# EasyEDA Pro project USB_C_BREADBOARD_PD.eprj, schematic Schematic3
Board Name: SMART_V; Create Date: 2025-01-21; Page Name: P1; Project Name: USB_C_BREADBOARD_PD; Schematic Name: Schematic3; Update Date: 2025-01-20; Company: EasyEDA.com; Page Size: A4; Version: V1.0
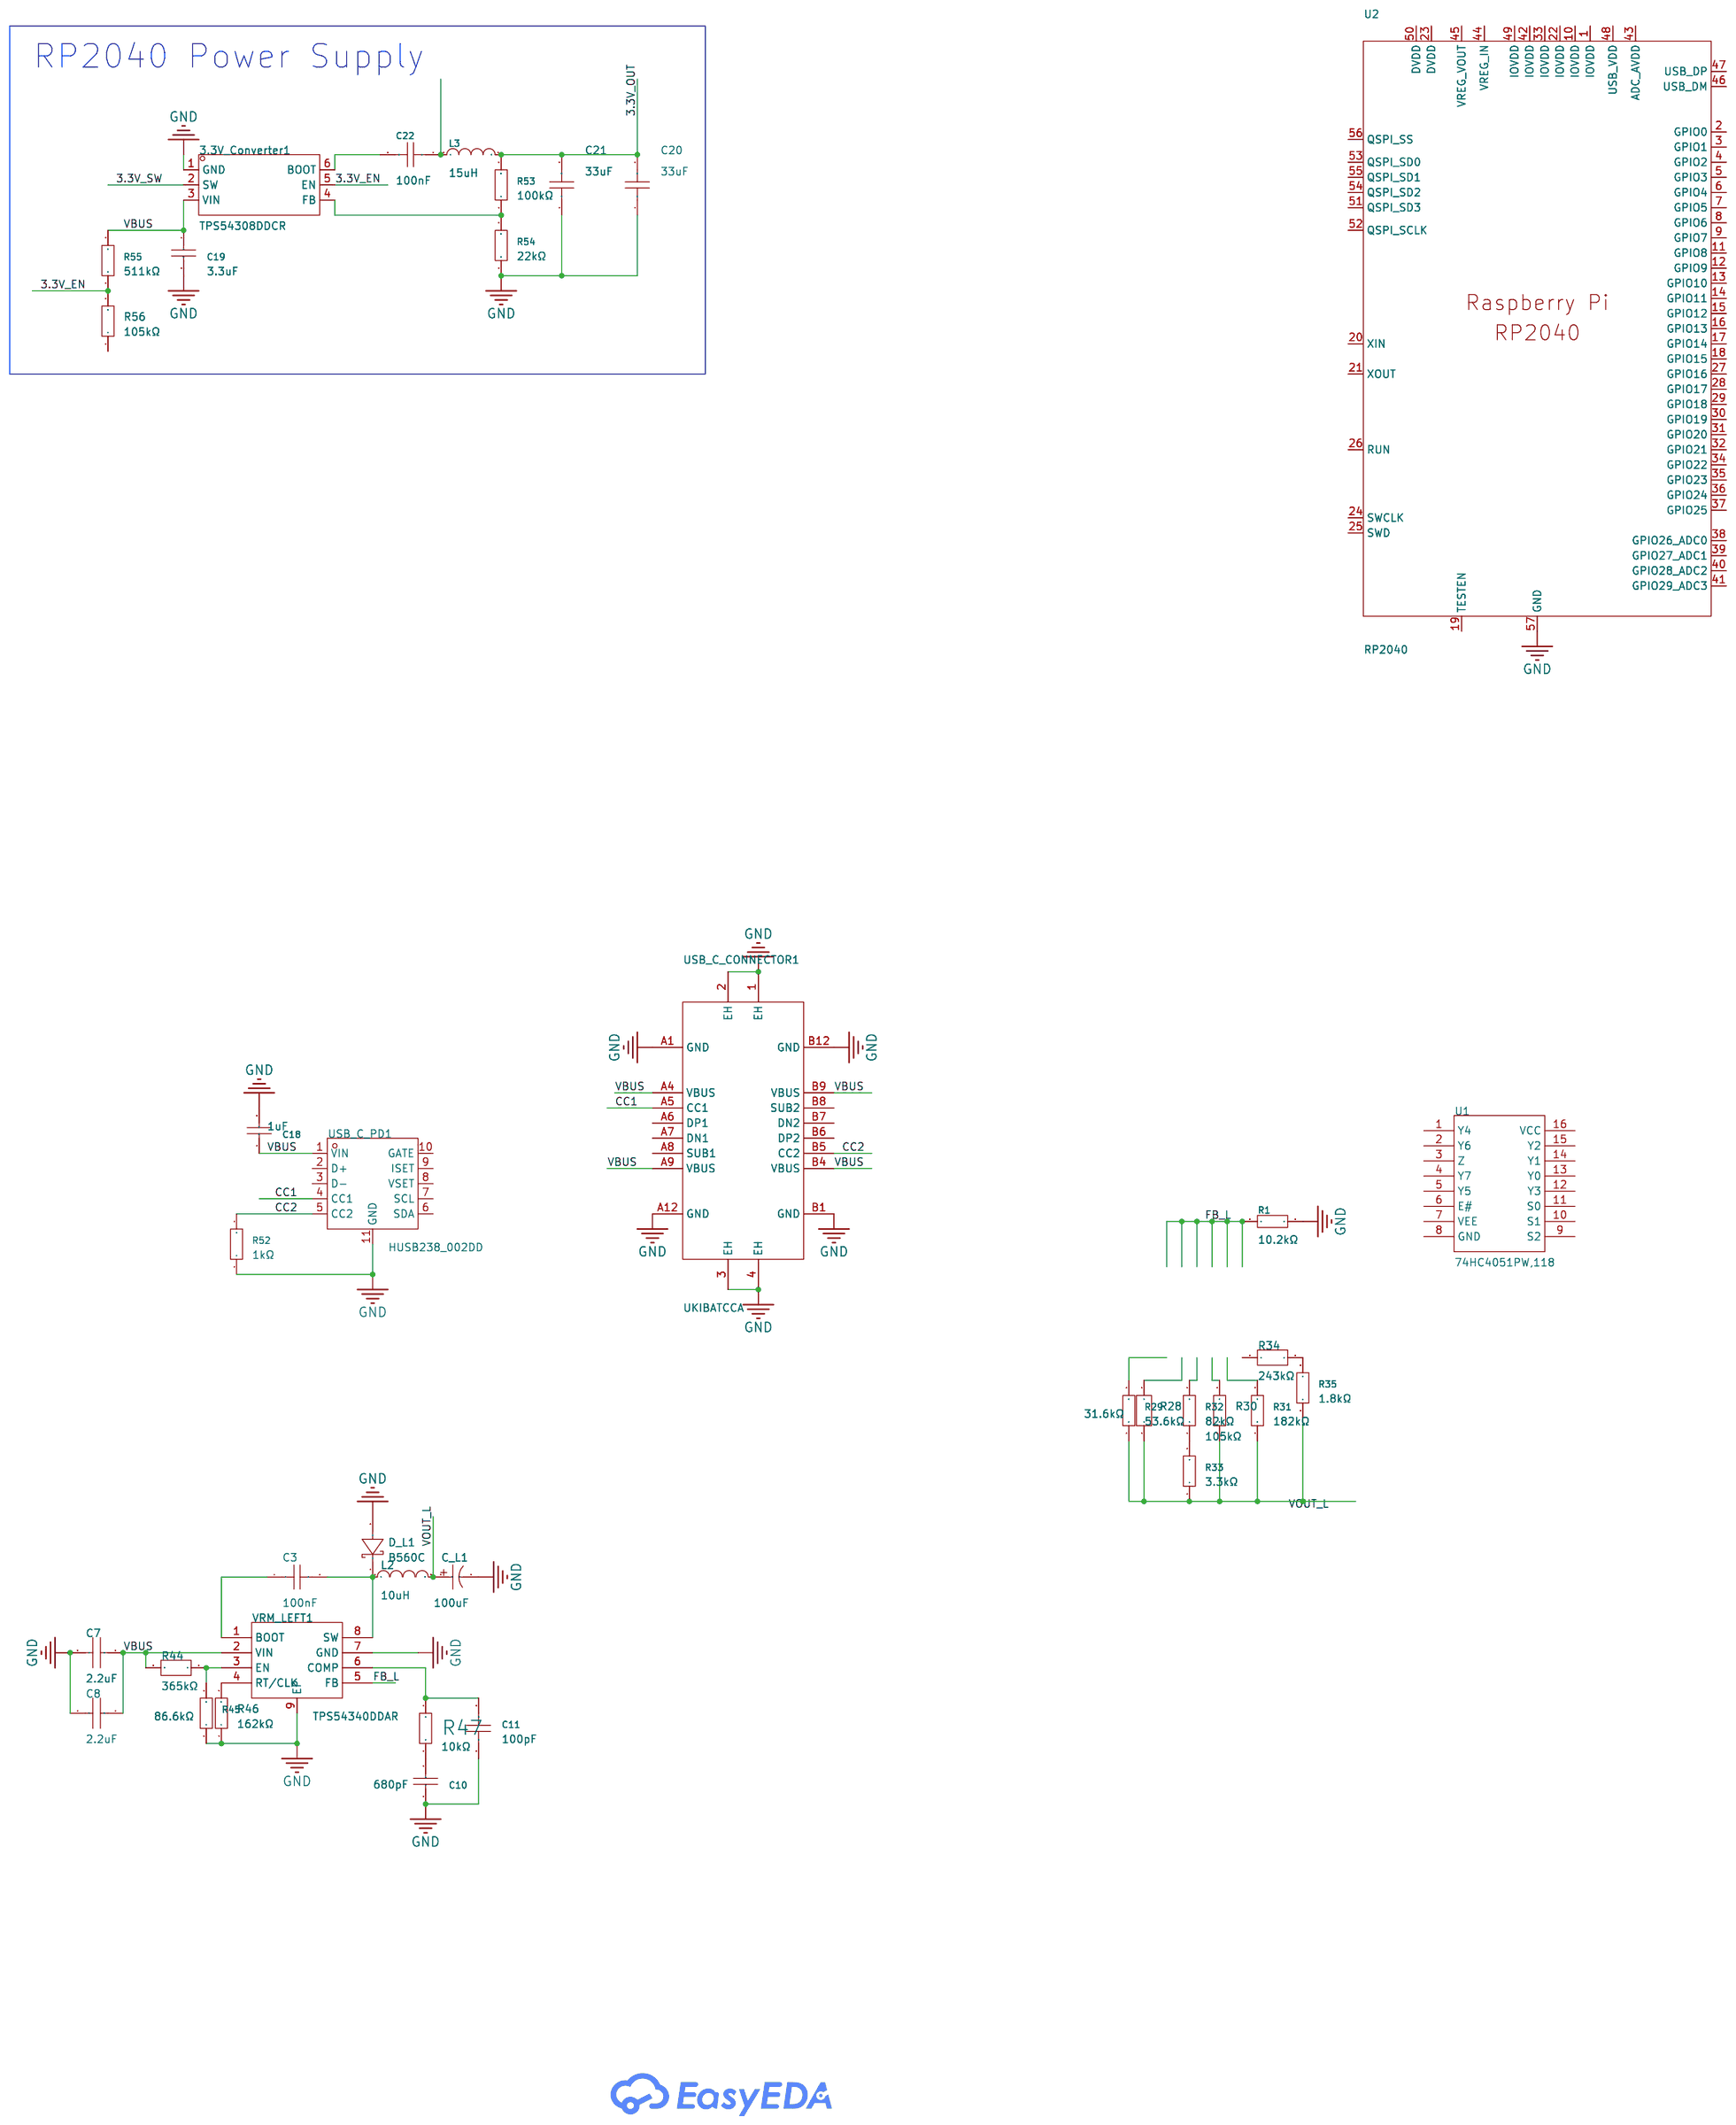
[diagram p2: schematic sheet]

## Parts
3.3V_Converter1  TPS54308DDCR  [SOT-23-6_L2.9-W1.6-P0.95-LS2.8-BR]
C3  100nF  [C0603]
C7  2.2uF  [C0402]
C8  2.2uF  [C0402]
C10  680pF  [C0603]
C11  100pF  [C0603]
C18  1uF  [C0402]
C19  3.3uF  [C1206]
C20  33uF  [C0805]
C21  33uF  [C0805]
C22  100nF  [C0603]
C_L1  100uF  [CAP-SMD_BD6.3-L6.6-W6.6-LS7.6-FD]
D_L1  B560C  [SMC_L6.9-W5.9-LS7.9-RD]
L2  10uH  [IND-SMD_L7.3-W6.8]
L3  15uH  [IND-SMD_L3.0-W3.0_LQH3NPN]
R1  10.2kΩ  [R0402]
R28  53.6kΩ  [R0603]
R29  31.6kΩ  [R0603]
R30  105kΩ  [R0603]
R31  182kΩ  [R0603]
R32  82kΩ  [R0603]
R33  3.3kΩ  [R0603]
R34  243kΩ  [R0603]
R35  1.8kΩ  [R0603]
R44  365kΩ  [R0603]
R45  86.6kΩ  [R0603]
R46  162kΩ  [R0603]
R47  10kΩ  [R0603]
R52  1kΩ  [R0402]
R53  100kΩ  [R0402]
R54  22kΩ  [R0603]
R55  511kΩ  [R0402]
R56  105kΩ  [R0603]
U1  74HC4051PW,118  [TSSOP-16_L5.0-W4.4-P0.65-LS6.4-BL]
U2  RP2040  [LQFN-56_L7.0-W7.0-P0.4-EP]
USB_C_CONNECTOR1  UKIBATCCA  [USB-C-SMD_UKIBATCCA]
USB_C_PD1  HUSB238_002DD  [DFN-10_L3.0-W3.0-P0.50-BL-EP2.5]
VRM_LEFT1  TPS54340DDAR  [SOIC-8_L4.9-W3.9-P1.27-LS6.0-BL-EP3.3]

## Library data of the parts
3.3V_Converter1 = TPS54308DDCR: LCSC Part Name: 4.5V至28V输入,3A输出同步降压转换器; Supplier Part: C168839; Manufacturer: TI(德州仪器); Supplier Footprint: SOT-23-6; JLCPCB Part Class: Extended Part; Datasheet: https://www.ti.com/cn/lit/gpn/tps54308; Supplier: LCSC; Function: Step-down type; Output Type: Fixed; Input Voltage: 4.5V~28V; Output Voltage: 3.3V; Output Current: 3A; Switching Frequency: 350kHz; Operating Temperature: -40℃~+125℃; Synchronous Rectification: Yes; Number of Outputs: 1; Topology: Step-down; Quiescent Current (Iq): 300uA; Switch tube (built-in/external): Built-in
C3 = CGA0603X7R104K500JT: LCSC Part Name: 100nF ±10% 50V; Supplier Part: C6119867; Manufacturer: HRE(芯声); Supplier Footprint: 0603; JLCPCB Part Class: Extended Part; Supplier: LCSC; Tolerance: ±10%; Voltage Rated: 50V
C7 C8 = CL05A225MQ5NSNC: LCSC Part Name: 2.2uF ±20% 6.3V; Supplier Part: C12530; Manufacturer: SAMSUNG(三星); Supplier Footprint: 0402; JLCPCB Part Class: Basic Part; Datasheet: https://atta.szlcsc.com/upload/public/pdf/source/20160218/1457707763339.pdf; Supplier: LCSC; Tolerance: ±20%
C10 = CC0603JRNPO9BN681: LCSC Part Name: 680pF ±5% 50V; Supplier Part: C107055; Manufacturer: YAGEO(国巨); Supplier Footprint: 0603; JLCPCB Part Class: Extended Part; Datasheet: https://atta.szlcsc.com/upload/public/pdf/source/20170914/C128857_1505359892143968080.pdf; Supplier: LCSC; Tolerance: ±5%
C11 = CC0603JRNPO9BN101: LCSC Part Name: 100pF ±5% 50V; Supplier Part: C14665; Manufacturer: YAGEO(国巨); Supplier Footprint: 0603; JLCPCB Part Class: Extended Part; Datasheet: https://atta.szlcsc.com/upload/public/pdf/source/20181008/C309499_21CC21451B82C39E3D92150FD6B30293.pdf; Supplier: LCSC; Tolerance: ±5%
C18 = CL05A105KO5NNNC: LCSC Part Name: 1uF ±10% 16V; Supplier Part: C29266; Manufacturer: SAMSUNG(三星); Supplier Footprint: 0402; JLCPCB Part Class: Extended Part; Datasheet: https://atta.szlcsc.com/upload/public/pdf/source/20160218/1457707763339.pdf; Supplier: LCSC; Tolerance: ±10%
C19 = C3216X7R1E335KT000N: LCSC Part Name: 3.3uF ±10% 25V; Supplier Part: C76663; Manufacturer: TDK; Supplier Footprint: 1206; JLCPCB Part Class: Extended Part; Datasheet: https://atta.szlcsc.com/upload/public/pdf/source/20191009/C435256_A698304126E0DD2EAD15F9D05758F127.pdf; Supplier: LCSC; Tolerance: ±10%
C20 C21 = C2012X5R1A336MTJ00E: LCSC Part Name: 33uF ±20% 10V; Supplier Part: C342635; Manufacturer: TDK; Supplier Footprint: 0805; JLCPCB Part Class: Extended Part; Datasheet: https://atta.szlcsc.com/upload/public/pdf/source/20190612/C361180_85CC9FB0751BEA97238DE56AB4AF0B1F.pdf; Supplier: LCSC; Tolerance: ±20%
C22 = CC0603KRX7R9BB104: LCSC Part Name: 100nF ±10% 50V; Supplier Part: C14663; Manufacturer: YAGEO(国巨); Supplier Footprint: 0603; JLCPCB Part Class: Basic Part; Datasheet: https://atta.szlcsc.com/upload/public/pdf/source/20180910/C282072_33301C7F631E79921B82A8DAC6BCC5B3.pdf; Supplier: LCSC; Tolerance: ±10%
C_L1 = RVT1V101M0607_C72478: LCSC Part Name: 100uF ±20% 35V; Supplier Part: C72478; Manufacturer: ROQANG(容强); Manufacturer Part: RVT1V101M0607; Supplier Footprint: SMD,D6.3xL7.7mm; JLCPCB Part Class: Extended Part; Datasheet: https://atta.szlcsc.com/upload/public/pdf/source/20170325/1490427950282.pdf; Supplier: LCSC; Tolerance: ±20%; Ripple Current: 69mA@120Hz; Lifetime @ Temp: 2000hrs@105℃; Operating Temperature: -40℃~+105℃
D_L1 = B560C_C6807784: LCSC Part Name: 电压:60V 电流:5A; Supplier Part: C6807784; Manufacturer: FUXINSEMI(富芯森美); Supplier Footprint: SMC(DO-214AB); JLCPCB Part Class: Extended Part; Datasheet: https://atta.szlcsc.com/upload/public/pdf/source/20230727/BBD047E09E3983A1DBEAE079A1E2DA84.pdf; Supplier: LCSC; Diode Configuration: Independent Type; Forward Voltage (Vf@If): 700mV@5A; Reverse Voltage (Vr): 60V; Rectified Current: 5A; Reverse Leakage Current (Ir): 100uA@60V
L2 = FXL0630-100-M: LCSC Part Name: 10uH ±20% 5.5A; Supplier Part: C167223; Manufacturer: cjiang(长江微电); Supplier Footprint: SMD,6.6x7mm; JLCPCB Part Class: Extended Part; Datasheet: https://atta.szlcsc.com/upload/public/pdf/source/20240426/3189EA8206330E2108542F9E34E540E7.pdf; Supplier: LCSC; Tolerance: ±20%; Saturation Current (Isat): 5.5A; Type: Integrated molded inductor
L3 = LQH3NPN150MMEL: LCSC Part Name: 15uH ±20% 660mA; Supplier Part: C668450; Manufacturer: muRata(村田); Supplier Footprint: SMD,3x3mm; JLCPCB Part Class: Extended Part; Datasheet: https://atta.szlcsc.com/upload/public/pdf/source/20191022/C440248_094C93E028FCF0FA66FA57BC1ADCD3EF.pdf; Supplier: LCSC; Tolerance: ±20%; Saturation Current (Isat): 660mA
R1 = 0402WGF1022TCE: LCSC Part Name: 10.2kΩ ±1% 62.5mW 厚膜电阻; Supplier Part: C11660; Manufacturer: UNI-ROYAL(厚声); Supplier Footprint: 0402; JLCPCB Part Class: Extended Part; Datasheet: https://atta.szlcsc.com/upload/public/pdf/source/20200306/C422600_1E6D84923E4A46A82E41ADD87F860B5C.pdf; Supplier: LCSC; Type: Thick Film Resistors; Tolerance: ±1%; Temperature Coefficient: ±100ppm/℃; Operating Temperature Range: -55℃~+155℃
R28 = FRC0603F5362TS: LCSC Part Name: 53.6kΩ ±1% 100mW 厚膜电阻; Supplier Part: C2930115; Manufacturer: FOJAN(富捷); Supplier Footprint: 0603; JLCPCB Part Class: Extended Part; Datasheet: https://atta.szlcsc.com/upload/public/pdf/source/20211221/925EC7D7225764EE0046F22065062C87.pdf; Supplier: LCSC; Type: Thick Film Resistors; Tolerance: ±1%; Temperature Coefficient: ±100ppm/℃; Operating Temperature Range: -55℃~+155℃
R29 = 0603WAF3162T5E: LCSC Part Name: 31.6kΩ ±1% 100mW 厚膜电阻; Supplier Part: C25967; Manufacturer: UNI-ROYAL(厚声); Supplier Footprint: 0603; JLCPCB Part Class: Extended Part; Datasheet: https://atta.szlcsc.com/upload/public/pdf/source/20200306/C422600_1E6D84923E4A46A82E41ADD87F860B5C.pdf; Supplier: LCSC; Type: Thick Film Resistors; Tolerance: ±1%; Temperature Coefficient: ±100ppm/℃; Operating Temperature Range: -55℃~+155℃
R30 R56 = 0603WAF1053T5E: LCSC Part Name: 105kΩ ±1% 100mW 厚膜电阻; Supplier Part: C16840; Manufacturer: UNI-ROYAL(厚声); Supplier Footprint: 0603; JLCPCB Part Class: Extended Part; Datasheet: https://atta.szlcsc.com/upload/public/pdf/source/20200306/C422600_1E6D84923E4A46A82E41ADD87F860B5C.pdf; Supplier: LCSC; Type: Thick Film Resistors; Tolerance: ±1%; Temperature Coefficient: ±100ppm/℃; Operating Temperature Range: -55℃~+155℃
R31 = 0603WAF1823T5E: LCSC Part Name: 182kΩ ±1% 100mW 厚膜电阻; Supplier Part: C22894; Manufacturer: UNI-ROYAL(厚声); Supplier Footprint: 0603; JLCPCB Part Class: Extended Part; Datasheet: https://atta.szlcsc.com/upload/public/pdf/source/20200306/C422600_1E6D84923E4A46A82E41ADD87F860B5C.pdf; Supplier: LCSC; Type: Thick Film Resistors; Tolerance: ±1%; Temperature Coefficient: ±100ppm/℃; Operating Temperature Range: -55℃~+155℃
R32 = 0603WAF8202T5E: LCSC Part Name: 82kΩ ±1% 100mW 厚膜电阻; Supplier Part: C23254; Manufacturer: UNI-ROYAL(厚声); Supplier Footprint: 0603; JLCPCB Part Class: Basic Part; Datasheet: https://atta.szlcsc.com/upload/public/pdf/source/20200306/C422600_1E6D84923E4A46A82E41ADD87F860B5C.pdf; Supplier: LCSC; Type: Thick Film Resistors; Tolerance: ±1%; Temperature Coefficient: ±100ppm/℃; Operating Temperature Range: -55℃~+155℃
R33 = 0603WAF3301T5E: LCSC Part Name: 3.3kΩ ±1% 100mW 厚膜电阻; Supplier Part: C22978; Manufacturer: UNI-ROYAL(厚声); Supplier Footprint: 0603; JLCPCB Part Class: Basic Part; Datasheet: https://atta.szlcsc.com/upload/public/pdf/source/20200306/C422600_1E6D84923E4A46A82E41ADD87F860B5C.pdf; Supplier: LCSC; Type: Thick Film Resistors; Tolerance: ±1%; Temperature Coefficient: ±100ppm/℃; Operating Temperature Range: -55℃~+155℃
R34 = FRC0603F2433TS: LCSC Part Name: 厚膜电阻 243kΩ ±1% 100mW; Supplier Part: C7467321; Manufacturer: FOJAN(富捷); Supplier Footprint: 0603; JLCPCB Part Class: Extended Part; Datasheet: https://atta.szlcsc.com/upload/public/pdf/source/20211221/9022FBEBBD509006A57EBC43C1F2F40C.pdf; Supplier: LCSC; Type: Thick Film Resistors; Tolerance: ±1%; Temperature Coefficient: ±100ppm/℃
R35 = 0603WAF1801T5E: LCSC Part Name: 1.8kΩ ±1% 100mW 厚膜电阻; Supplier Part: C4177; Manufacturer: UNI-ROYAL(厚声); Supplier Footprint: 0603; JLCPCB Part Class: Basic Part; Datasheet: https://atta.szlcsc.com/upload/public/pdf/source/20200306/C422600_1E6D84923E4A46A82E41ADD87F860B5C.pdf; Supplier: LCSC; Type: Thick Film Resistors; Tolerance: ±1%; Temperature Coefficient: ±100ppm/℃; Operating Temperature Range: -55℃~+155℃
R44 = FRC0603F3653TS: LCSC Part Name: 厚膜电阻 365kΩ 100mW ±1%; Supplier Part: C19267399; Manufacturer: FOJAN(富捷); Supplier Footprint: 0603; JLCPCB Part Class: Extended Part; Datasheet: https://atta.szlcsc.com/upload/public/pdf/source/20230825/D7BB05C431FE4193B31D29C3AB35173D.pdf; Supplier: LCSC; Type: Thick Film Resistors; Tolerance: ±1%; Temperature Coefficient: ±100ppm/℃
R45 = 0603WAF8662T5E: LCSC Part Name: 86.6kΩ ±1% 100mW 厚膜电阻; Supplier Part: C23121; Manufacturer: UNI-ROYAL(厚声); Supplier Footprint: 0603; JLCPCB Part Class: Extended Part; Datasheet: https://atta.szlcsc.com/upload/public/pdf/source/20200306/C422600_1E6D84923E4A46A82E41ADD87F860B5C.pdf; Supplier: LCSC; Type: Thick Film Resistors; Tolerance: ±1%; Temperature Coefficient: ±100ppm/℃; Operating Temperature Range: -55℃~+155℃
R46 = 0603WAF1623T5E: LCSC Part Name: 162kΩ ±1% 100mW 厚膜电阻; Supplier Part: C22815; Manufacturer: UNI-ROYAL(厚声); Supplier Footprint: 0603; JLCPCB Part Class: Extended Part; Datasheet: https://atta.szlcsc.com/upload/public/pdf/source/20200306/C422600_1E6D84923E4A46A82E41ADD87F860B5C.pdf; Supplier: LCSC; Type: Thick Film Resistors; Tolerance: ±1%; Temperature Coefficient: ±100ppm/℃; Operating Temperature Range: -55℃~+155℃
R47 = 0603WAF1002T5E: LCSC Part Name: 厚膜电阻 10kΩ ±1% 100mW; Supplier Part: C25804; Manufacturer: UNI-ROYAL(厚声); Supplier Footprint: 0603; JLCPCB Part Class: Basic Part; Datasheet: https://atta.szlcsc.com/upload/public/pdf/source/20200306/C422600_1E6D84923E4A46A82E41ADD87F860B5C.pdf; Supplier: LCSC; Type: Thick Film Resistors; Tolerance: ±1%; Temperature Coefficient: ±100ppm/℃; Operating Temperature Range: -55℃~+155℃
R52 = 0402WGF1001TCE: LCSC Part Name: 1kΩ ±1% 62.5mW 厚膜电阻; Supplier Part: C11702; Manufacturer: UNI-ROYAL(厚声); Supplier Footprint: 0402; JLCPCB Part Class: Basic Part; Datasheet: https://atta.szlcsc.com/upload/public/pdf/source/20200306/C422600_1E6D84923E4A46A82E41ADD87F860B5C.pdf; Supplier: LCSC; Type: Thick Film Resistors; Tolerance: ±1%; Temperature Coefficient: ±100ppm/℃; Operating Temperature Range: -55℃~+155℃
R53 = 0402WGF1003TCE: LCSC Part Name: 100kΩ ±1% 62.5mW 厚膜电阻; Supplier Part: C25741; Manufacturer: UNI-ROYAL(厚声); Supplier Footprint: 0402; JLCPCB Part Class: Basic Part; Datasheet: https://atta.szlcsc.com/upload/public/pdf/source/20200306/C422600_1E6D84923E4A46A82E41ADD87F860B5C.pdf; Supplier: LCSC; Type: Thick Film Resistors; Tolerance: ±1%; Temperature Coefficient: ±100ppm/℃; Operating Temperature Range: -55℃~+155℃
R54 = 0603WAF2202T5E: LCSC Part Name: 22kΩ ±1% 100mW 厚膜电阻; Supplier Part: C31850; Manufacturer: UNI-ROYAL(厚声); Supplier Footprint: 0603; JLCPCB Part Class: Basic Part; Datasheet: https://atta.szlcsc.com/upload/public/pdf/source/20200306/C422600_1E6D84923E4A46A82E41ADD87F860B5C.pdf; Supplier: LCSC; Type: Thick Film Resistors; Tolerance: ±1%; Temperature Coefficient: ±100ppm/℃; Operating Temperature Range: -55℃~+155℃
R55 = 0402WGF5113TCE: LCSC Part Name: 511kΩ ±1% 62.5mW 厚膜电阻; Supplier Part: C64042; Manufacturer: UNI-ROYAL(厚声); Supplier Footprint: 0402; JLCPCB Part Class: Extended Part; Datasheet: https://atta.szlcsc.com/upload/public/pdf/source/20200306/C422600_1E6D84923E4A46A82E41ADD87F860B5C.pdf; Supplier: LCSC; Type: Thick Film Resistors; Tolerance: ±1%; Temperature Coefficient: ±100ppm/℃; Operating Temperature Range: -55℃~+155℃
U1 = 74HC4051PW,118: LCSC Part Name: 8通道模拟多路复用器/解复用器; Supplier Part: C5645; Manufacturer: Nexperia(安世); Supplier Footprint: TSSOP-16; JLCPCB Part Class: Extended Part; Datasheet: https://atta.szlcsc.com/upload/public/pdf/source/20240724/55B145ED26B61CE203AD3BB6AD5921DA.pdf; Supplier: LCSC; Switch Circuit: SP8T single pole eight throw; Number of Channels: 8; Supply Voltage: 2V~10V; Turn-on time: 345ns; On-State Resistance (Max): 225Ω; Turn-off time: 365ns; Operating Temperature: -40℃~+125℃
U2 = RP2040_C2040: LCSC Part Name: RP2040（RP2B2）; Supplier Part: C2040; Manufacturer: Raspberry Pi(树莓派); Supplier Footprint: LQFN-56(7x7); JLCPCB Part Class: Extended Part; Datasheet: https://atta.szlcsc.com/upload/public/pdf/source/20210621/C2040_96F425825606B7957D87DD32E2512CA9.pdf; Supplier: LCSC; RAM Size: 264KB; GPIO Ports Number: 30; CPU Maximum Speed: 133MHz; ADC (Bit): 12bit; UART/USART: 2; I2C: 2; SPI: 2; Universal Serial Bus: 有; Peripheral/Function: DMA；PWM; Direct Memory Access: 有
USB_C_CONNECTOR1 = UKIBATCCA: LCSC Part Name: Type-C 母 卧贴; Supplier Part: C29780877; Manufacturer: SAMZO(三佐); Supplier Footprint: SMD; JLCPCB Part Class: Extended Part; Datasheet: https://atta.szlcsc.com/upload/public/pdf/source/20240717/32BE29DCF56E1C8211E6A8D6AE117405.pdf; Supplier: LCSC; Connector Type: Type-C; Gender: Female; Mounting Style: Horizontal attachment; Number of Contacts: 16P; Number of Ports: 1; Current Rating - Power (Max): 5A; Rated Voltage (Max): 20V; Connect-Disconnect Life: 10,000 times; Length: 6.5mm; Core Colour: Black; Operating Temperature Range: -25℃~+85℃
USB_C_PD1 = HUSB238_002DD: Supplier Part: C7471904; Manufacturer: Hynetek(慧能泰); Supplier Footprint: DFN-10L(3x3); JLCPCB Part Class: Extended Part; Datasheet: https://atta.szlcsc.com/upload/public/pdf/source/20240407/14E2BCB22C39B22B34E48E1B6FC2FE3E.pdf; Supplier: LCSC
VRM_LEFT1 = TPS54340DDAR: LCSC Part Name: 42V输入3.5A降压DC-DC转换器; Supplier Part: C45886; Manufacturer: TI(德州仪器); Supplier Footprint: SOIC-8-EP; JLCPCB Part Class: Extended Part; Datasheet: https://www.ti.com/cn/lit/gpn/tps54340; Supplier: LCSC; Function: Step-down type; Output Type: Adjustable; Input Voltage: 4.5V~42V; Output Voltage: 800mV~41.1V; Output Current: 3.5A; Switching Frequency: 2.5MHz; Operating Temperature: -40℃~+150℃@(TJ); Synchronous Rectification: No; Number of Outputs: 1; Topology: Step-down; Switch tube (built-in/external): Built-in

## Nets
3.3V_EN: 3.3V_Converter1.5(EN) R55.1 R56.2
3.3V_OUT: C20.2 C21.2 L3.2 R53.2
3.3V_SW: 3.3V_Converter1.2(SW)
GND: 3.3V_Converter1.1(GND) C7.2 C8.2 C10.1 C11.1 C18.2 C19.2 C20.1 C21.1 C_L1.2 D_L1.2(A) R1.2 R45.1 R46.1 R52.1 R54.1 U2.57(GND) USB_C_CONNECTOR1.1(EH) USB_C_CONNECTOR1.2(EH) USB_C_CONNECTOR1.3(EH) USB_C_CONNECTOR1.4(EH) USB_C_CONNECTOR1.A1(GND) USB_C_CONNECTOR1.A12(GND) USB_C_CONNECTOR1.B1(GND) USB_C_CONNECTOR1.B12(GND) USB_C_PD1.11(GND) VRM_LEFT1.7(GND) VRM_LEFT1.9(EP)
VBUS: 3.3V_Converter1.3(VIN) C7.1 C8.1 C18.1 C19.1 R44.2 R55.2 USB_C_CONNECTOR1.A4(VBUS) USB_C_CONNECTOR1.A9(VBUS) USB_C_CONNECTOR1.B4(VBUS) USB_C_CONNECTOR1.B9(VBUS) USB_C_PD1.1(VIN) VRM_LEFT1.2(VIN)
CC1: USB_C_CONNECTOR1.A5(CC1) USB_C_PD1.4(CC1)
CC2: R52.2 USB_C_CONNECTOR1.B5(CC2) USB_C_PD1.5(CC2)
FB_L: R1.1 VRM_LEFT1.5(FB)
VOUT_L: C_L1.1 L2.2 R28.1 R29.1 R30.1 R31.1 R33.1 R35.1
Net-(3.3V_Converter1-4): 3.3V_Converter1.4(FB) R53.1 R54.2
Net-(3.3V_Converter1-6): 3.3V_Converter1.6(BOOT) C22.2
Net-(C3-1): C3.1 VRM_LEFT1.1(BOOT)
Net-(C3-2): C3.2 D_L1.1(K) L2.1 VRM_LEFT1.8(SW)
Net-(C10-2): C10.2 R47.1
Net-(C11-2): C11.2 R47.2 VRM_LEFT1.6(COMP)
Net-(C22-1): C22.1 L3.1
Net-(R32-1): R32.1 R33.2
Net-(R34-2): R34.2 R35.2
Net-(R44-1): R44.1 R45.2 VRM_LEFT1.3(EN)
Net-(R46-2): R46.2 VRM_LEFT1.4(RT/CLK)

Not connected (* = marked no-connect by the designer): R28 2; R29 2; R30 2; R31 2; R32 2; R34 1; R56 1; U1 1(Y4) 2(Y6) 3(Z) 4(Y7) 5(Y5) 6(E#) 7(VEE) 8(GND) 9(S2) 10(S1) 11(S0) 12(Y3) 13(Y0) 14(Y1) 15(Y2) 16(VCC); U2 1(IOVDD) 2(GPIO0) 3(GPIO1) 4(GPIO2) 5(GPIO3) 6(GPIO4) 7(GPIO5) 8(GPIO6) 9(GPIO7) 10(IOVDD) 11(GPIO8) 12(GPIO9) 13(GPIO10) 14(GPIO11) 15(GPIO12) 16(GPIO13) 17(GPIO14) 18(GPIO15) 19(TESTEN) 20(XIN) 21(XOUT) 22(IOVDD) 23(DVDD) 24(SWCLK) 25(SWD) 26(RUN) 27(GPIO16) 28(GPIO17) 29(GPIO18) 30(GPIO19) 31(GPIO20) 32(GPIO21) 33(IOVDD) 34(GPIO22) 35(GPIO23) 36(GPIO24) 37(GPIO25) 38(GPIO26_ADC0) 39(GPIO27_ADC1) 40(GPIO28_ADC2) 41(GPIO29_ADC3) 42(IOVDD) 43(ADC_AVDD) 44(VREG_IN) 45(VREG_VOUT) 46(USB_DM) 47(USB_DP) 48(USB_VDD) 49(IOVDD) 50(DVDD) 51(QSPI_SD3) 52(QSPI_SCLK) 53(QSPI_SD0) 54(QSPI_SD2) 55(QSPI_SD1) 56(QSPI_SS); USB_C_CONNECTOR1 A6(DP1) A7(DN1) A8(SUB1) B6(DP2) B7(DN2) B8(SUB2); USB_C_PD1 2(D+) 3(D-) 6(SDA) 7(SCL) 8(VSET) 9(ISET) 10(GATE)

## Notes on the sheet
- RP2040 Power Supply
